# EAGLE design all (EAGLE 9.6.2)
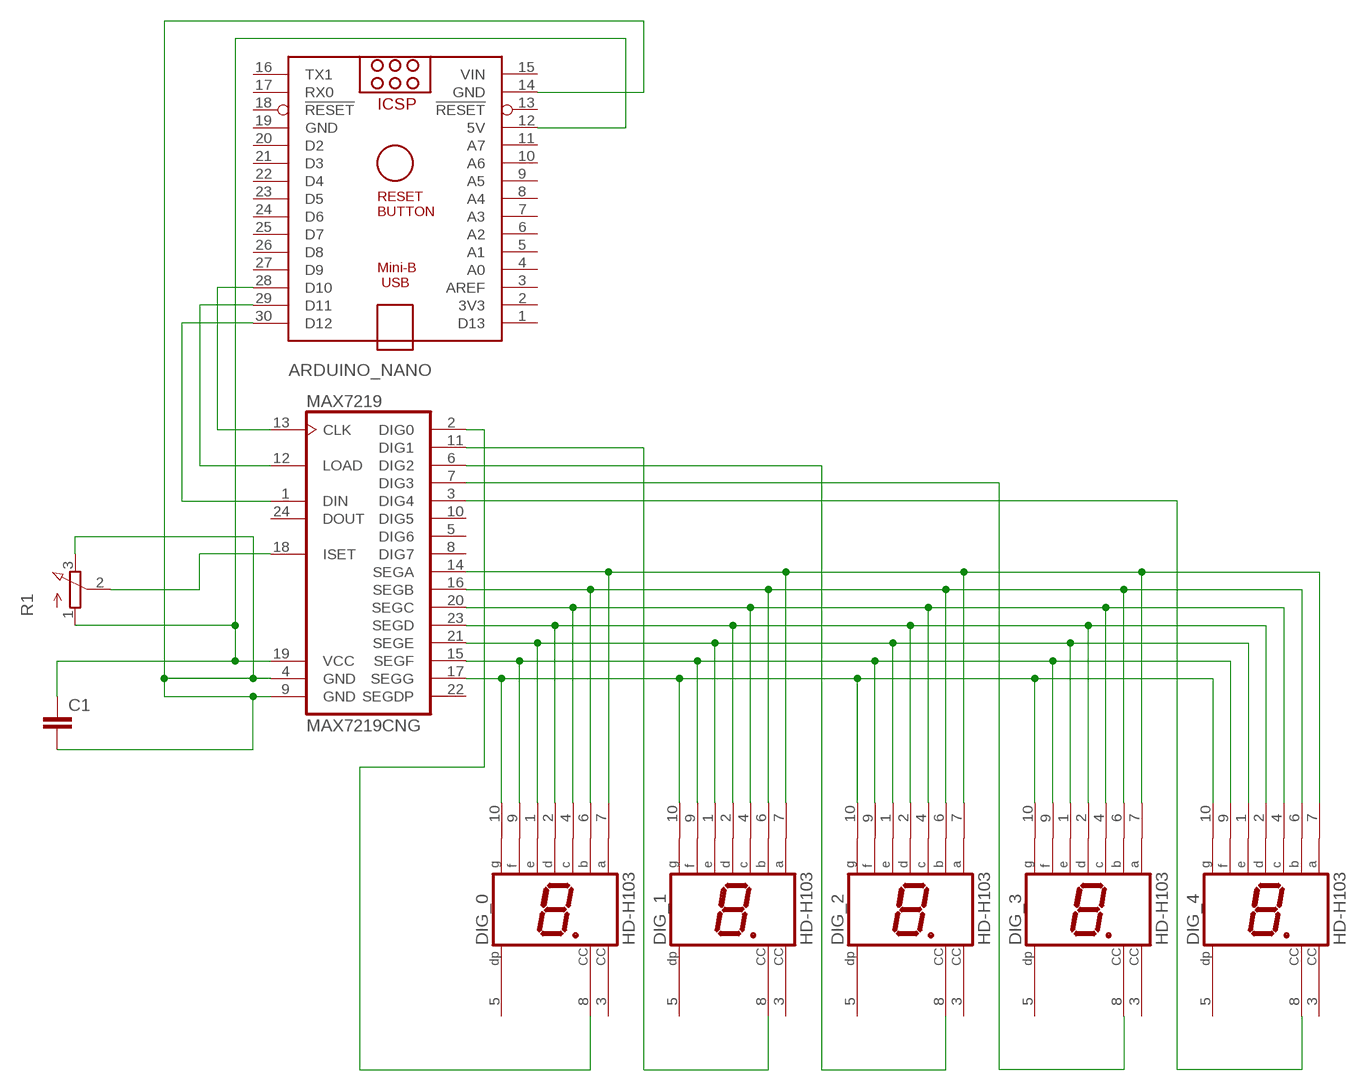
[diagram p0: schematic, sheet 1]

## Parts
ARDUINO_NANO  ARDUINO_NANO  [ARDUINO_NANO]
C1  C2,5-3  [C2.5-3]
DIG_0  HD-H103  [HDSP-M]
DIG_1  HD-H103  [HDSP-M]
DIG_2  HD-H103  [HDSP-M]
DIG_3  HD-H103  [HDSP-M]
DIG_4  HD-H103  [HDSP-M]
MAX7219  MAX7219CNG  [DIL24-3]
R1  3RP/1610N  [3RP/1610N]

## Nets
N$1: DIG_1.8(CC) MAX7219.11(DIG1)
N$2: DIG_0.8(CC) MAX7219.2(DIG0)
N$3: DIG_2.8(CC) MAX7219.6(DIG2)
N$4: DIG_3.8(CC) MAX7219.7(DIG3)
N$5: DIG_4.8(CC) MAX7219.3(DIG4)
N$6: DIG_0.7(A) DIG_1.7(A) DIG_2.7(A) DIG_3.7(A) DIG_4.7(A) MAX7219.14(SEGA)
N$7: DIG_0.6(B) DIG_1.6(B) DIG_2.6(B) DIG_3.6(B) DIG_4.6(B) MAX7219.16(SEGB)
N$8: DIG_0.4(C) DIG_1.4(C) DIG_2.4(C) DIG_3.4(C) DIG_4.4(C) MAX7219.20(SEGC)
N$9: DIG_0.2(D) DIG_1.2(D) DIG_2.2(D) DIG_3.2(D) DIG_4.2(D) MAX7219.23(SEGD)
N$10: DIG_0.1(E) DIG_1.1(E) DIG_2.1(E) DIG_3.1(E) DIG_4.1(E) MAX7219.21(SEGE)
N$11: DIG_0.9(F) DIG_1.9(F) DIG_2.9(F) DIG_3.9(F) DIG_4.9(F) MAX7219.15(SEGF)
N$12: DIG_0.10(G) DIG_1.10(G) DIG_2.10(G) DIG_3.10(G) DIG_4.10(G) MAX7219.17(SEGG)
N$13: ARDUINO_NANO.28(D10) MAX7219.13(CLK)
N$14: ARDUINO_NANO.29(D11) MAX7219.12(LOAD)
N$15: ARDUINO_NANO.30(D12) MAX7219.1(DIN)
N$17: ARDUINO_NANO.12(5V) C1.1 MAX7219.19(VCC) R1.1(A)
N$18: MAX7219.18(ISET) R1.2(S)
N$20: ARDUINO_NANO.14(GND) C1.2 MAX7219.4(GND) MAX7219.9(GND) R1.3(E)
Unconnected: ARDUINO_NANO.1(D13) ARDUINO_NANO.2(3V3) ARDUINO_NANO.3(AREF) ARDUINO_NANO.4(A0) ARDUINO_NANO.5(A1) ARDUINO_NANO.6(A2) ARDUINO_NANO.7(A3) ARDUINO_NANO.8(A4) ARDUINO_NANO.9(A5) ARDUINO_NANO.10(A6) ARDUINO_NANO.11(A7) ARDUINO_NANO.13(!RESET) ARDUINO_NANO.16(TX1) ARDUINO_NANO.17(RX0) ARDUINO_NANO.18(!RESET) ARDUINO_NANO.20(D2) ARDUINO_NANO.21(D3) ARDUINO_NANO.22(D4) ARDUINO_NANO.23(D5) ARDUINO_NANO.24(D6) ARDUINO_NANO.25(D7) ARDUINO_NANO.26(D8) ARDUINO_NANO.27(D9) DIG_0.3(CC) DIG_0.5(DP) DIG_1.3(CC) DIG_1.5(DP) DIG_2.3(CC) DIG_2.5(DP) DIG_3.3(CC) DIG_3.5(DP) DIG_4.3(CC) DIG_4.5(DP) MAX7219.5(DIG6) MAX7219.8(DIG7) MAX7219.10(DIG5) MAX7219.22(SEGDP) MAX7219.24(DOUT)

## Power pins joined to a net without a drawn wire
GND: ARDUINO_NANO.19(GND)
VIN: ARDUINO_NANO.15(VIN)

## Library data of the parts
ARDUINO_NANO = ArduinoNanoV30:ARDUINO_NANO: Arduino Nano V3.0 Overview: The Arduino Nano is a small, complete, and breadboard-friendly board based on the ATmega328 (Arduino Nano 3.x) or ATmega168 (Arduino Nano 2.x). It has more or less the same functionality of the Arduino Duemilanove, but in a different package. It lacks only a DC power jack, and works with a Mini-B USB cable instead of a standard one. The Nano was designed and is being produced by Gravitech. Specifications: Microcontroller Atmel ATmega168 or ATmega328 Operating Voltage (logic level) 5 V Input Voltage (recommended) 7-12 V Input Voltage (limits) 6-20 V Digital I/O Pins 14 (of which 6 provide PWM output) Analog Input Pins 8 DC Current per I/O Pin 40 mA Flash Memory 16 KB (ATmega168) or 32 KB (ATmega328) of which 2 KB used by bootloader SRAM 1 KB (ATmega168) or 2 KB (ATmega328) EEPROM 512 bytes (ATmega168) or 1 KB (ATmega328) Clock Speed 16 MHz Dimensions 0.73" x 1.70" Length 45 mm Width 18 mm Weigth 5 g Power: The Arduino Nano can be powered via the Mini-B USB connection, 6-20V unregulated external power supply (pin 30), or 5V regulated external power supply (pin 27). The power source is automatically selected to the highest voltage source. Memory: The ATmega168 has 16 KB of flash memory for storing code (of which 2 KB is used for the bootloader); the ATmega328 has 32 KB, (also with 2 KB used for the bootloader). The ATmega168 has 1 KB of SRAM and 512 bytes of EEPROM (which can be read and written with the EEPROM library); the ATmega328 has 2 KB of SRAM and 1 KB of EEPROM. Input and Output: Each of the 14 digital pins on the Nano can be used as an input or output, using pinMode(), digitalWrite(), and digitalRead() functions. They operate at 5 volts. Each pin can provide or receive a maximum of 40 mA and has an internal pull-up resistor (disconnected by default) of 20-50 kOhms. In addition, some pins have specialized functions. Visit Arduino - ArduinoBoardNano <https://www.arduino.cc/en/Main/ArduinoBoardNano>
C1 = capacitor-wima:C: CAPACITOR naming: grid - package width
DIG_0 DIG_1-DIG_4 = display-hp:HD-H103: LED DISPLAY 1-character 7 segment, decimal point right; OC_FARNELL: unknown; OC_NEWARK: unknown
MAX7219 = maxim:MAX7219CNG: LED DISPLAY DRIVER; MF: MAXIM; MPN: MAX7219CNG; OC_FARNELL: 1523914; OC_NEWARK: 34C4018
R1 = pot:3RP/1610N: 16mm Potentiometer one level Source: http://www.alphapotentiometers.net/html/16mm_pot_2.html

## Board
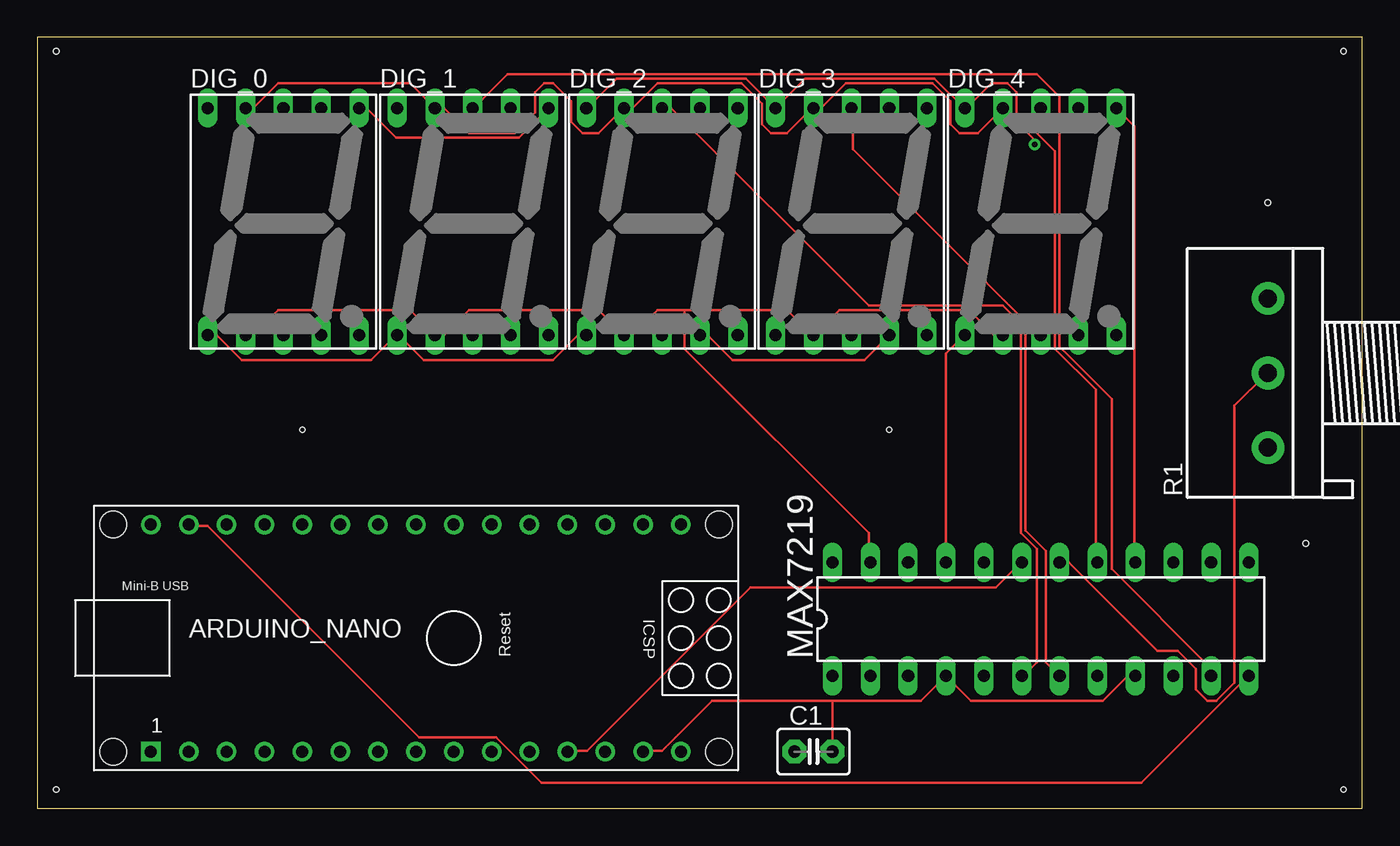
[diagram p1: board, top side]
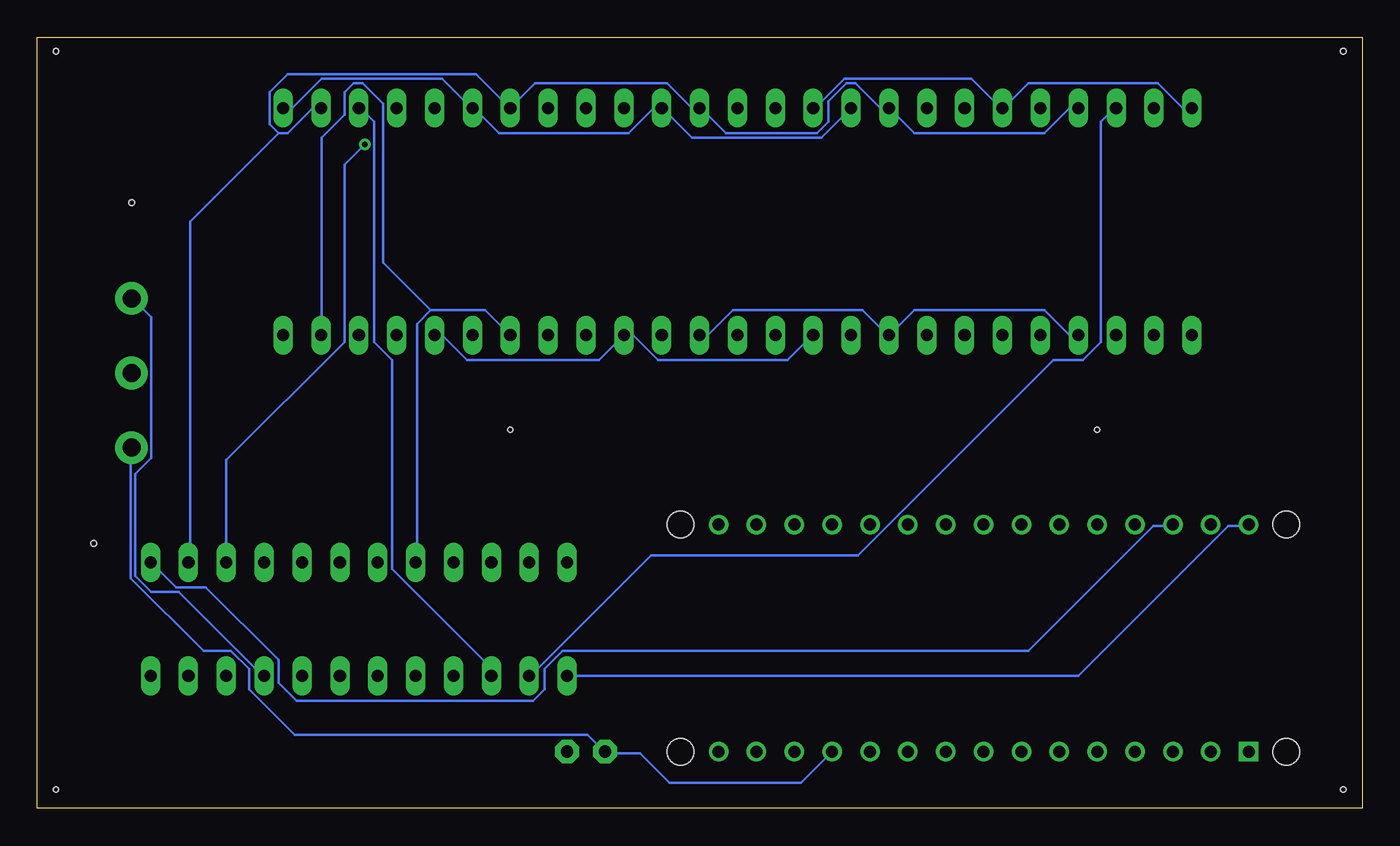
[diagram p2: board, bottom side, seen from below]

Size 88.88 x 51.74 mm. Coordinates in mm from the lower left corner, seen from the top.
Outline: 0,0 88.88,0 88.88,51.74 0,51.74 0,0
Copper layers (1*16): Top 0.035mm / dielectric 1.5mm / Bottom 0.035mm
Design rules "default": minimum track width 6mil, minimum drill 0.35mm, track to track 6mil, track to pad 6mil, pad to pad 6mil, via to via 6mil, smd to smd 6mil, copper to edge 40mil, drill to drill 6mil, minimum pad ring 10mil, minimum via ring 8mil, stop-mask expansion 4mil, vias tented up to drill 0mil, thermal gap 10mil
Holes 0.35 mm at 1.27,1.27 1.27,50.8 87.63,50.8 87.63,1.27 17.78,25.4 57.15,25.4 82.55,40.64 85.09,17.78

### Footprints (pad centres in the part's own frame; a part is rotated, then mirrored left to right if it is on the bottom)
ARDUINO_NANO = drill 0.8 square: 1 -20.32,-7.62 | drill 0.8: 2 -17.78,-7.62; 3 -15.24,-7.62; 4 -12.7,-7.62; 5 -10.16,-7.62; 6 -7.62,-7.62; 7 -5.08,-7.62; 8 -2.54,-7.62; 9 0,-7.62; 10 2.54,-7.62; 11 5.08,-7.62; 12 7.62,-7.62; 13 10.16,-7.62; 14 12.7,-7.62; 15 15.24,-7.62; 16 15.24,7.62; 17 12.7,7.62; 18 10.16,7.62; 19 7.62,7.62; 20 5.08,7.62; 21 2.54,7.62; 22 0,7.62; 23 -2.54,7.62; 24 -5.08,7.62; 25 -7.62,7.62; 26 -10.16,7.62; 27 -12.7,7.62; 28 -15.24,7.62; 29 -17.78,7.62; 30 -20.32,7.62 | hole 1.778: -22.86,-7.62; -22.86,7.62; 17.78,7.62; 17.78,-7.62
C2.5-3 = drill 0.813 pad 1.6 octagon: 1 -1.27,0; 2 1.27,0
HDSP-M = drill 0.813 long: 1 -5.08,-7.62; 2 -2.54,-7.62; 3 0,-7.62; 4 2.54,-7.62; 5 5.08,-7.62; 6 5.08,7.62; 7 2.54,7.62; 8 0,7.62; 9 -2.54,7.62; 10 -5.08,7.62
DIL24-3 = drill 0.813 long: 1 -13.97,-3.81; 2 -11.43,-3.81; 3 -8.89,-3.81; 4 -6.35,-3.81; 5 -3.81,-3.81; 6 -1.27,-3.81; 7 1.27,-3.81; 8 3.81,-3.81; 9 6.35,-3.81; 10 8.89,-3.81; 11 11.43,-3.81; 12 13.97,-3.81; 13 13.97,3.81; 14 11.43,3.81; 15 8.89,3.81; 16 6.35,3.81; 17 3.81,3.81; 18 1.27,3.81; 19 -1.27,3.81; 20 -3.81,3.81; 21 -6.35,3.81; 22 -8.89,3.81; 23 -11.43,3.81; 24 -13.97,3.81
3RP/1610N = drill 1.2 pad 2.184: 1 -5,0; 2 0,0; 3 5,0

### Placement (x,y rotation side)
ARDUINO_NANO  27.94,11.43 0 top
C1  52.07,3.81 0 top
DIG_0  16.51,39.37 0 top
DIG_1  29.21,39.37 0 top
DIG_2  41.91,39.37 0 top
DIG_3  54.61,39.37 0 top
DIG_4  67.31,39.37 0 top
MAX7219  67.31,12.7 0 top
R1  82.55,29.21 90 top

### Tracks (layer width: path | path; a pad name or v marks a point on that pad's centre or on a via)
N$1
  Top 0.152: MAX7219.11 78.64,8.89 78.64,9.5 72.08,16.05 72.08,27.48 68.58,30.99 68.58,47.75 67.06,49.28 31.55,49.28 29.26,46.99 DIG_1.8
N$2
  Bottom 0.152: MAX7219.2 55.78,8.89 47.7,16.97 33.83,16.97 20.73,30.07 18.75,30.07 17.53,31.29 17.53,46.08 16.61,46.99 DIG_0.8
N$3
  Top 0.152: DIG_2.8 42.52,46.99 55.78,33.73 64.77,33.73 65.99,32.51 65.99,18.49 67.06,17.42 67.06,9.8 66.14,8.89 MAX7219.6
N$4
  Top 0.152: MAX7219.7 67.67,9.8 67.67,17.27 66.29,18.64 66.29,32.66 54.71,44.25 54.71,46.99 DIG_3.8
N$5
  Bottom 0.152: MAX7219.3 58.52,8.89 58.52,9.5 65.08,16.05 65.08,30.07 66.29,31.29 66.29,46.08 67.21,46.99 DIG_4.8
N$6
  Bottom 0.152: DIG_0.7 19.66,46.99 21.34,45.31 30.02,45.31 31.7,46.99 DIG_1.7 32.31,46.99 33.98,48.67 34.59,48.67 35.81,47.45 35.81,46.08 36.58,45.31 42.67,45.31 44.35,46.99 DIG_2.7 44.96,46.99 46.63,48.67 55.47,48.67 DIG_3.7 59.44,49.28 72.08,49.28 73.3,48.06 73.3,45.92 72.69,45.31 | DIG_4.7 70.41,46.99 72.08,45.31 72.69,45.31 | 72.69,45.31 78.64,39.37 78.64,16.51 MAX7219.14
N$7
  Top 0.152: DIG_0.6 22.1,46.99 24.08,45.01 32.31,45.01 DIG_1.6 | DIG_4.6 73.61,45.77 73.61,16.51 MAX7219.16
  Bottom 0.152: DIG_4.6 71.78,46.99 69.8,48.97 61.72,48.97 59.74,46.99 DIG_3.6 59.59,46.99 57.91,45.31 49.23,45.31 47.55,46.99 DIG_2.6 46.94,46.99 44.96,45.01 36.27,45.01 DIG_1.6
N$8
  Top 0.152: DIG_2.4 44.96,31.75 46.63,30.07 55.47,30.07 DIG_3.4
  Bottom 0.152: DIG_0.4 19.66,31.75 21.34,33.43 30.02,33.43 31.7,31.75 DIG_1.4 31.85,31.75 33.53,33.43 42.22,33.43 43.89,31.75 DIG_2.4 | 62.48,33.43 63.4,32.51 63.4,16.51 MAX7219.20 | 62.48,33.43 58.83,33.43 DIG_3.4 | 62.48,33.43 65.68,36.63 65.68,47.3 67.06,48.67 67.67,48.67 68.28,48.06 68.28,46.53 69.8,45.01 69.8,31.75 DIG_4.4
N$9
  Top 0.152: DIG_0.2 14.48,31.75 16.15,33.43 24.99,33.43 DIG_1.2 27.28,31.75 28.96,33.43 37.64,33.43 39.32,31.75 DIG_2.2 39.93,31.75 41.6,33.43 43.43,33.43 | 43.43,33.43 50.29,33.43 51.97,31.75 DIG_3.2 52.12,31.75 53.8,33.43 62.48,33.43 64.16,31.75 DIG_4.2 | 43.43,33.43 43.43,30.84 55.78,18.49 55.78,16.51 MAX7219.23
N$10
  Top 0.152: MAX7219.21 60.96,30.53 62.18,31.75 DIG_4.1 | DIG_0.1 12.04,31.75 13.72,30.07 22.4,30.07 24.08,31.75 DIG_1.1 24.23,31.75 25.91,30.07 34.59,30.07 36.27,31.75 DIG_2.1
  Bottom 0.152: DIG_2.1 36.88,31.75 38.56,30.07 47.24,30.07 48.92,31.75 DIG_3.1 51.21,30.07 60.05,30.07 61.72,31.75 DIG_4.1
N$11  (via drill 0.35)
  Top 0.152: DIG_0.9 14.48,46.99 16.15,48.67 24.99,48.67 DIG_1.9 27.28,46.99 28.96,45.31 32,45.31 33.38,46.68 33.38,48.06 33.98,48.67 34.59,48.67 35.81,47.45 35.81,46.08 36.58,45.31 37.64,45.31 39.32,46.99 DIG_2.9 39.93,46.99 41.6,48.67 47.24,48.67 48.62,47.3 48.62,45.92 49.23,45.31 50.29,45.31 51.97,46.99 DIG_3.9 52.58,46.99 54.25,48.67 60.05,48.67 61.27,47.45 61.27,45.92 61.87,45.31 63.09,45.31 DIG_4.9 66.9,44.86 v66.9,44.55
  Bottom 0.152: MAX7219.15 76.2,23.37 68.28,31.29 68.28,43.18 v66.9,44.55
N$12
  Top 0.152: DIG_2.10 36.88,46.99 38.86,48.97 47.55,48.97 DIG_3.10 51.51,48.97 60.2,48.97 62.18,46.99 DIG_4.10 62.33,46.99 64.01,48.67 65.08,48.67 65.68,48.06 65.68,46.68 68.28,44.09 68.28,30.84 71.02,28.09 71.02,16.51 MAX7219.17
  Bottom 0.152: DIG_0.10 12.04,46.99 13.72,48.67 22.4,48.67 24.08,46.99 DIG_1.10 24.23,46.99 26.21,48.97 34.75,48.97 36.73,46.99 DIG_2.10
N$13
  Bottom 0.152: ARDUINO_NANO.28 12.8,18.95 14.02,18.95 22.4,10.57 53.65,10.57 54.86,9.35 54.86,7.98 55.63,7.21 71.48,7.21 72.69,8.43 72.69,9.96 77.57,14.83 79.55,14.83 81.23,16.51 MAX7219.13
N$14
  Top 0.152: ARDUINO_NANO.29 10.21,18.95 11.43,18.95 25.6,4.77 30.79,4.77 33.83,1.73 74.07,1.73 81.23,8.89 MAX7219.12
N$15
  Bottom 0.152: MAX7219.1 19.05,8.89 8.99,18.95 7.62,18.95 ARDUINO_NANO.30
N$17
  Top 0.152: ARDUINO_NANO.12 35.66,3.86 36.88,3.86 47.85,14.83 64.31,14.83 65.99,16.51 MAX7219.19
  Bottom 0.152: ARDUINO_NANO.12 37.64,1.73 46.48,1.73 48.46,3.71 50.75,3.71 C1.1 50.9,3.86 51.97,4.93 71.63,4.93 74.68,7.98 74.68,9.35 75.89,10.57 77.72,10.57 82.6,15.44 82.6,24.13 R1.1
N$18
  Top 0.152: MAX7219.18 69.19,16.51 75.13,10.57 76.5,10.57 77.72,9.35 77.72,7.98 78.49,7.21 79.1,7.21 80.31,8.43 80.31,27.03 82.45,29.16 R1.2
N$20
  Top 0.152: 53.34,7.21 59.28,7.21 MAX7219.4 62.64,7.21 71.48,7.21 73.15,8.89 MAX7219.9 | 53.34,7.21 45.26,7.21 41.91,3.86 40.69,3.86 ARDUINO_NANO.14 | 53.34,7.21 C1.2
  Bottom 0.152: MAX7219.9 73.76,8.89 79.4,14.53 81.23,14.53 82.3,15.6 82.3,22.45 81.23,23.52 81.23,32.97 82.45,34.19 R1.3